# Altium schematic sheet 3_Communication_Buffers.SchDoc
size A4
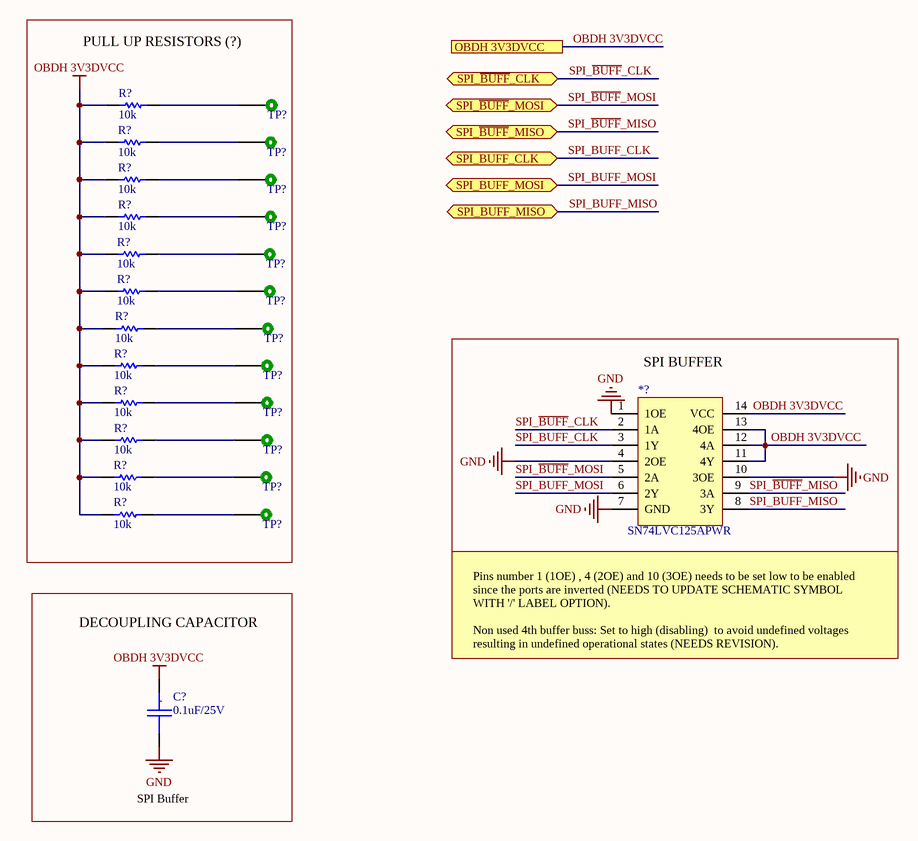
[diagram p0: 3_Communication_Buffers.SchDoc]

## Parts
(Parts that share a designator on the sheet are numbered #1, #2 ... from top to bottom, then left to right.)
*?  SN74LVC125APWR  [SN74LVC125APWR]
C?  0.1uF/25V  [CC0805]
R?#1  10k  [0805]
R?#2  10k  [0805]
R?#3  10k  [0805]
R?#4  10k  [0805]
R?#5  10k  [0805]
R?#6  10k  [0805]
R?#7  10k  [0805]
R?#8  10k  [0805]
R?#9  10k  [0805]
R?#10  10k  [0805]
R?#11  10k  [0805]
R?#12  10k  [0805]
TP?#1  TEST_POINT_2  [TEST_POINT_2]  (value not drawn)  (no BOM)
TP?#2  TEST_POINT_2  [TEST_POINT_2]  (value not drawn)  (no BOM)
TP?#3  TEST_POINT_2  [TEST_POINT_2]  (value not drawn)  (no BOM)
TP?#4  TEST_POINT_2  [TEST_POINT_2]  (value not drawn)  (no BOM)
TP?#5  TEST_POINT_2  [TEST_POINT_2]  (value not drawn)  (no BOM)
TP?#6  TEST_POINT_2  [TEST_POINT_2]  (value not drawn)  (no BOM)
TP?#7  TEST_POINT_2  [TEST_POINT_2]  (value not drawn)  (no BOM)
TP?#8  TEST_POINT_2  [TEST_POINT_2]  (value not drawn)  (no BOM)
TP?#9  TEST_POINT_2  [TEST_POINT_2]  (value not drawn)  (no BOM)
TP?#10  TEST_POINT_2  [TEST_POINT_2]  (value not drawn)  (no BOM)
TP?#11  TEST_POINT_2  [TEST_POINT_2]  (value not drawn)  (no BOM)
TP?#12  TEST_POINT_2  [TEST_POINT_2]  (value not drawn)  (no BOM)

## Blocks framed on the sheet
PULL UP RESISTORS (?): R?#1-R?#12 TP?#1-TP?#12
SPI BUFFER: *?
DECOUPLING CAPACITOR: C?

## Ports
OBDH 3V3DVCC, SPI_BUFF_CLK (bidir), SPI_BUFF_MISO (bidir), SPI_BUFF_MOSI (bidir), SPI_~{BUFF}_CLK (bidir), SPI_~{BUFF}_MISO (bidir), SPI_~{BUFF}_MOSI (bidir)

## Nets
GND: *?.1(1OE) *?.4(2OE) *?.7(GND) *?.10(3OE) C?.2
OBDH 3V3DVCC: *?.11(4Y) *?.12(4A) *?.13(4OE) *?.14(VCC) C?.1 R?#1.2 R?#2.2 R?#3.2 R?#4.2 R?#5.2 R?#6.2 R?#7.2 R?#8.2 R?#9.2 R?#10.2 R?#11.2 R?#12.2 ; port OBDH 3V3DVCC
SPI_~{BUFF}_CLK: *?.2(1A) ; port SPI_~{BUFF}_CLK
SPI_~{BUFF}_MISO: *?.9(3A) ; port SPI_~{BUFF}_MISO
SPI_~{BUFF}_MOSI: *?.5(2A) ; port SPI_~{BUFF}_MOSI
SPI_BUFF_CLK: *?.3(1Y) ; port SPI_BUFF_CLK
SPI_BUFF_MISO: *?.8(3Y) ; port SPI_BUFF_MISO
SPI_BUFF_MOSI: *?.6(2Y) ; port SPI_BUFF_MOSI
NetR?#1_1: R?#1.1 TP?#1.1
NetR?#2_1: R?#2.1 TP?#2.1
NetR?#3_1: R?#3.1 TP?#3.1
NetR?#4_1: R?#4.1 TP?#4.1
NetR?#5_1: R?#5.1 TP?#5.1
NetR?#6_1: R?#6.1 TP?#6.1
NetR?#7_1: R?#7.1 TP?#7.1
NetR?#8_1: R?#8.1 TP?#8.1
NetR?#9_1: R?#9.1 TP?#9.1
NetR?#10_1: R?#10.1 TP?#10.1
NetR?#11_1: R?#11.1 TP?#11.1
NetR?#12_1: R?#12.1 TP?#12.1

## Notes on the sheet
- Pins number 1 (1OE) , 4 (2OE) and 10 (3OE) needs to be set low to be enabled since the ports are inverted (NEEDS TO UPDATE SCHEMATIC SYMBOL WITH '/' LABEL OPTION).
  Non used 4th buffer buss: Set to high (disabling)  to avoid undefined voltages resulting in undefined operational states (NEEDS REVISION).
- SPI Buffer
- (in symbol Cap_Cer_X7R_0.1uF_25V_0805) .

## Library data of the parts
*? = SN74LVC125APWR: IC BUF NON-INVERT 3.6V 14TSSOP; Manufacturer: Texas Instruments; Number of Inputs: 4; Min Supply Voltage: 1.65V; Logic Function: Buffer,Inverting; Max Power Dissipation: 500mW; Propagation Delay: 4.6ns; Number of Bits per Element: 1; High Level Output Current: -24mA; Low Level Output Current: 24mA; Number of Output Lines: 3; Polarity: Non-Inverting; Turn-On Delay Time: 5.3ns; Quiescent Current: 1uA; Supplier 1: Digi-Key; Manufacturer Part Number: SN74LVC125APWR; Stock 1: 45045; Pricing 1: 1=0.47, 10=0.352, 25=0.3172, 100=0.2192, 250=0.18456, 500=0.14996, 1000=0.11536 (USD); Mount: Surface Mount; Case/Package: TSSOP; Number of Pins: 14; Contact Plating: Gold; Min Operating Temperature: -40°C; Max Operating Temperature: 125°C; Package Quantity: 1; Number of Elements: 4; Packaging: Tape and Reel; Max Supply Voltage: 3.6V; Number of Channels: 4; Number of Outputs: 4; Number of Input Lines: 4; Number of Bits: 4; Termination: SMD/SMT; Number of Circuits: 4; Number of Gates: 4; Length: 5mm; Height: 1.15mm; Width: 4.4mm; Radiation Hardening: No; REACH SVHC: No SVHC; Lead Free: Lead Free; ComponentLink1URL: http://www.ti.com/lit/ds/symlink/sn74lvc125a.pdf?src-supplier=Digi-Key; ComponentLink1Description: http://www.ti.com/lit/ds/symlink/sn74lvc125a.pdf?src-supplier=Digi-Key; ComponentLink2URL: http://www.ti.com/general/docs/lit/getliterature.tsp?genericPartNumber=SN74LVC125A&&fileType=pdf&src-supplier=Avnet; ComponentLink2Description: http://www.ti.com/general/docs/lit/getliterature.tsp?genericPartNumber=SN74LVC125A&&fileType=pdf&src-supplier=Avnet; ComponentLink3URL: http://www.farnell.com/datasheets/1764352.pdf?src-supplier=Element14; ComponentLink3Description: http://www.farnell.com/datasheets/1764352.pdf?src-supplier=Element14; ComponentLink4URL: http://www.produktinfo.conrad.com/datenblaetter/1000000-1099999/001017107-da-01-en-IC_BUS_BUF_Q_SN74LVC125APWR_TSSOP_14_TID.pdf?src-supplier=Conrad; ComponentLink4Description: http://www.produktinfo.conrad.com/datenblaetter/1000000-1099999/001017107-da-01-en-IC_BUS_BUF_Q_SN74LVC125APWR_TSSOP_14_TID.pdf?src-supplier=Conrad; Supplier Part Number 1: 296-1222-1-ND
C? = Cap_Cer_X7R_0.1uF_25V_0805: CAP CER 0.1UF 25V 10% X7R 0805; Partnumber: CC0805KRX7R8BB104; NCM: 8532.24.10
R?#1-R?#12 = R10k_1%_1/8W_0805: RES 10K OHM 1/8W 1%  0805; Partnumber: CRCW080510K0FKEA; NCM: 8533.21.20
TP?#1-TP?#12 = TEST_POINT_2: Test point